# Altium schematic sheet ADCS_Sensor_Simulator.SchDoc
size C
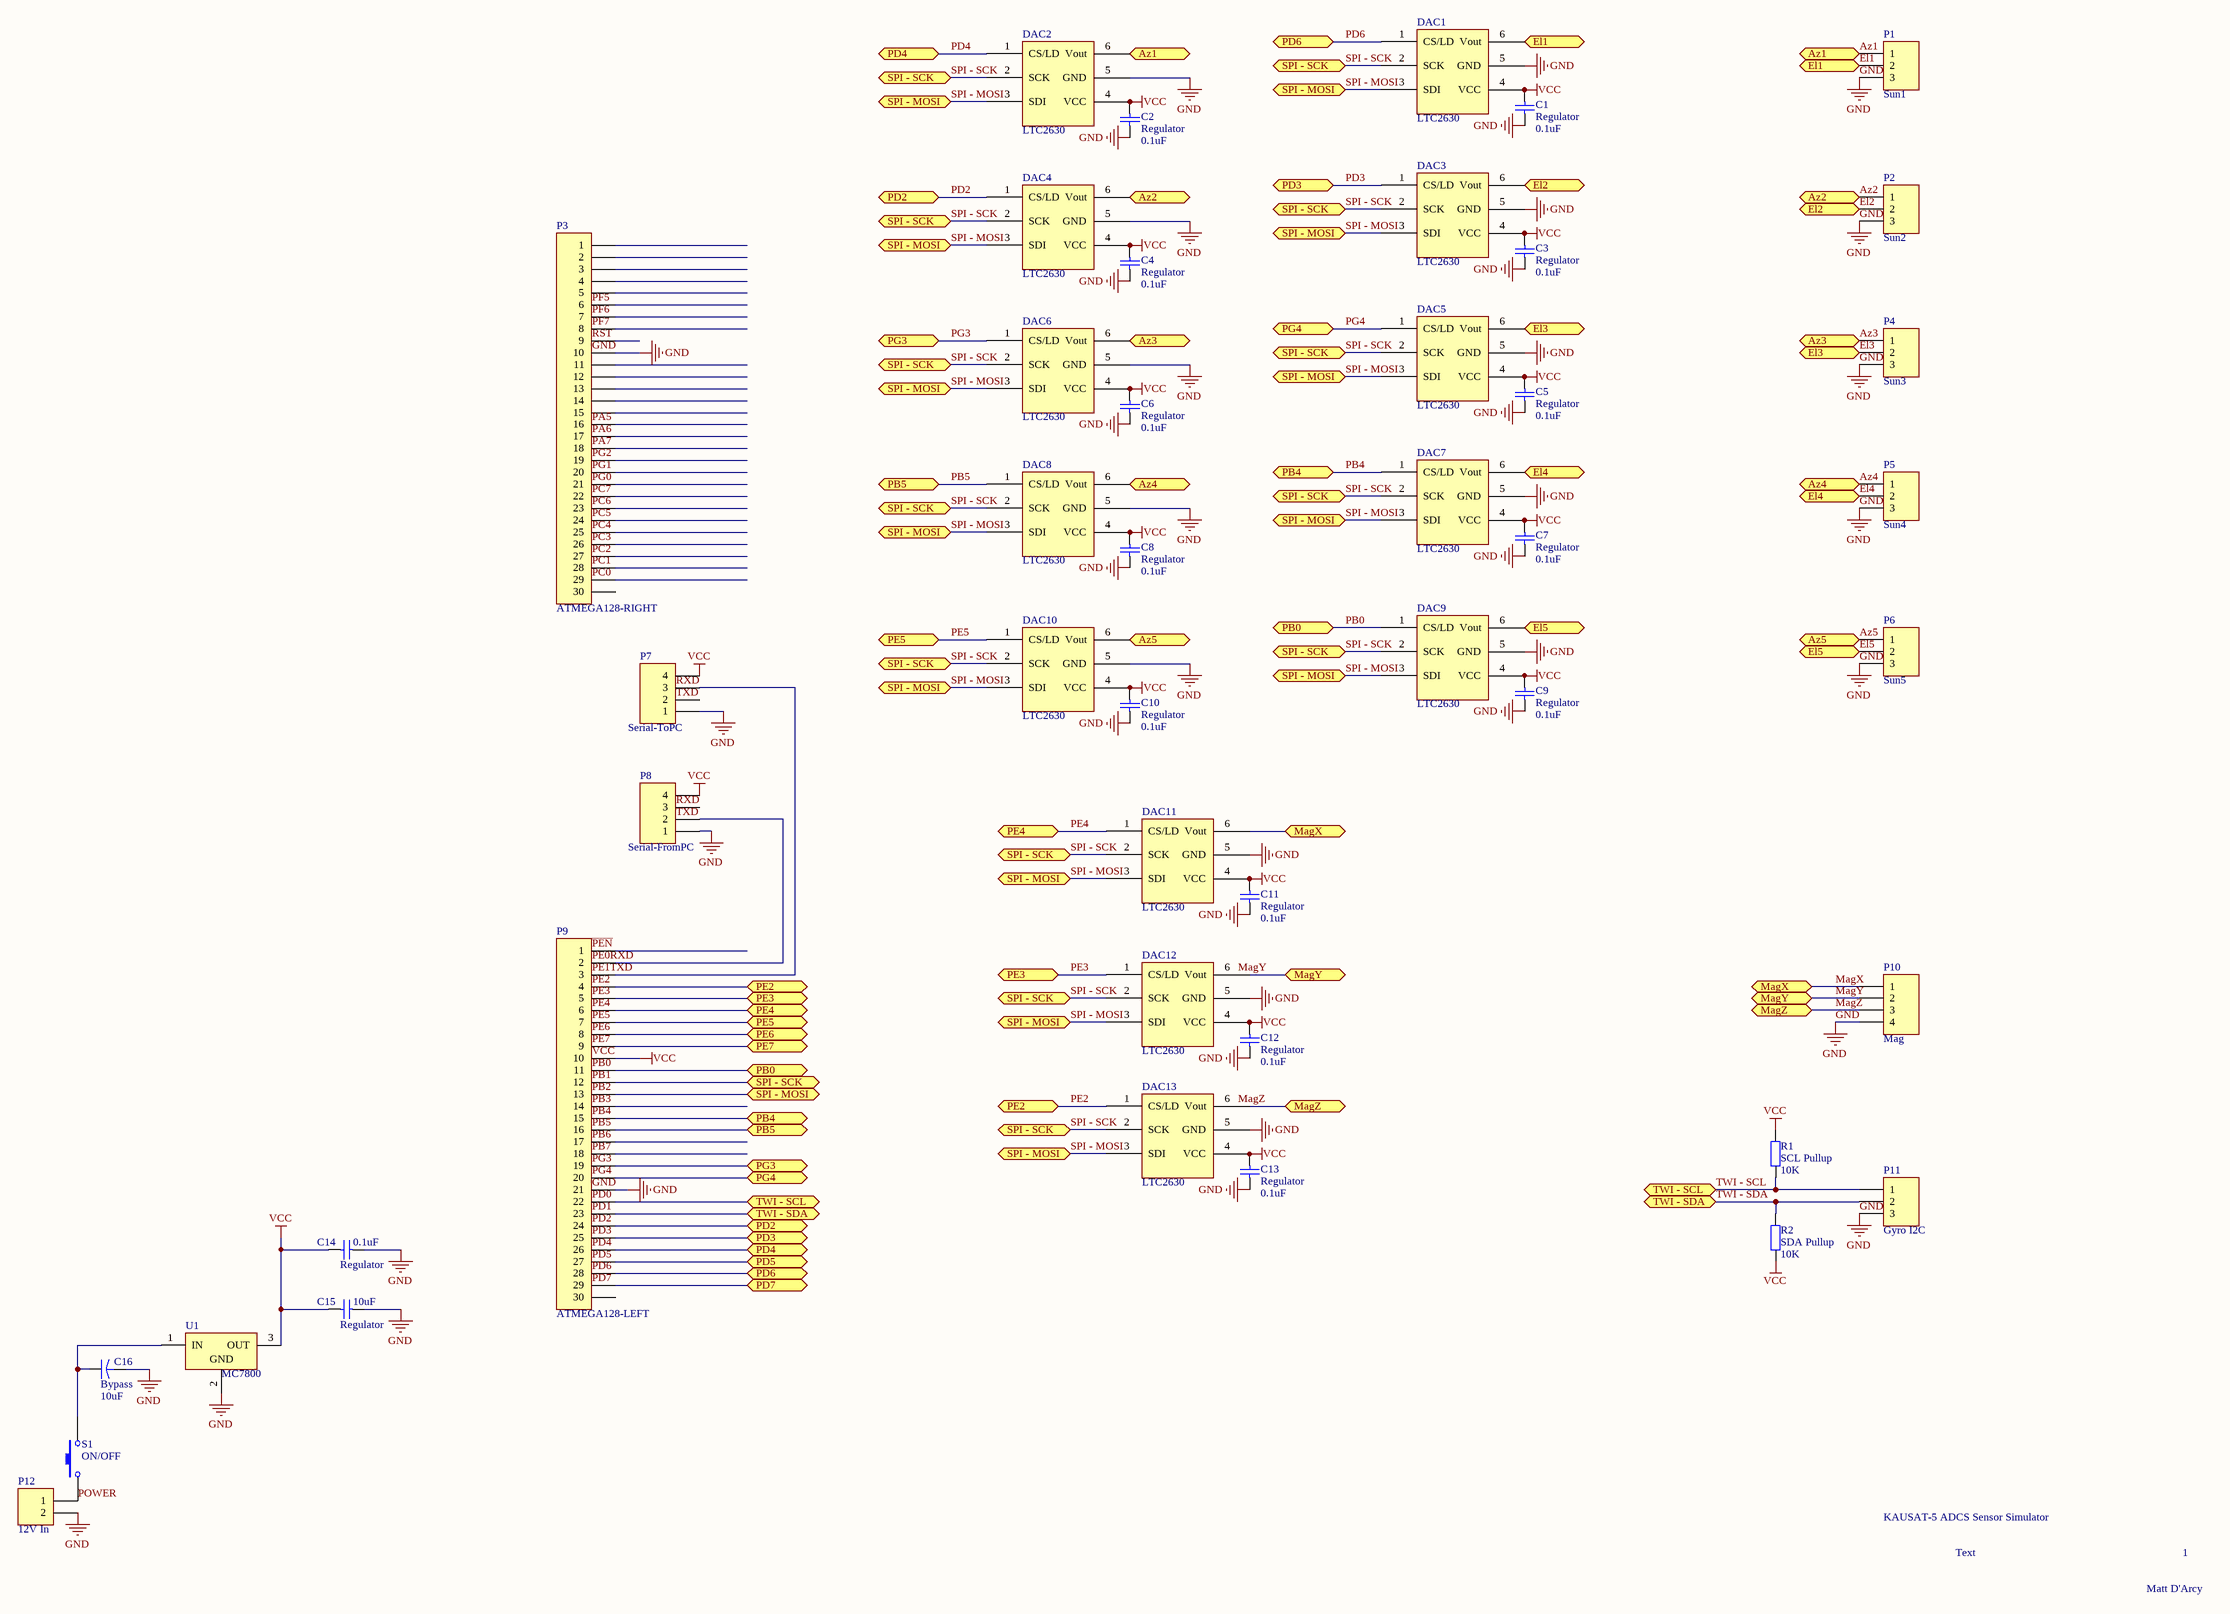
[diagram p0: ADCS_Sensor_Simulator.SchDoc]

## Parts
C1  Regulator  value 0.1uF  [6-0805_M]
C2  Regulator  value 0.1uF  [6-0805_M]
C3  Regulator  value 0.1uF  [6-0805_M]
C4  Regulator  value 0.1uF  [6-0805_M]
C5  Regulator  value 0.1uF  [6-0805_M]
C6  Regulator  value 0.1uF  [6-0805_M]
C7  Regulator  value 0.1uF  [6-0805_M]
C8  Regulator  value 0.1uF  [6-0805_M]
C9  Regulator  value 0.1uF  [6-0805_M]
C10  Regulator  value 0.1uF  [6-0805_M]
C11  Regulator  value 0.1uF  [6-0805_M]
C12  Regulator  value 0.1uF  [6-0805_M]
C13  Regulator  value 0.1uF  [6-0805_M]
C14  Regulator  value 0.1uF  [RAD-0.3]
C15  Regulator  value 10uF  [RAD-0.3]
C16  Bypass  value 10uF  [CAPR5-4X5]
DAC1  LTC2630  [LTC2630]
DAC2  LTC2630  [LTC2630]
DAC3  LTC2630  [LTC2630]
DAC4  LTC2630  [LTC2630]
DAC5  LTC2630  [LTC2630]
DAC6  LTC2630  [LTC2630]
DAC7  LTC2630  [LTC2630]
DAC8  LTC2630  [LTC2630]
DAC9  LTC2630  [LTC2630]
DAC10  LTC2630  [LTC2630]
DAC11  LTC2630  [LTC2630]
DAC12  LTC2630  [LTC2630]
DAC13  LTC2630  [LTC2630]
P1  Sun1  [HDR1X3]
P2  Sun2  [HDR1X3]
P3  ATMEGA128-RIGHT  [HDR1X30]
P4  Sun3  [HDR1X3]
P5  Sun4  [HDR1X3]
P6  Sun5  [HDR1X3]
P7  Serial-ToPC  [HDR1X4]
P8  Serial-FromPC  [HDR1X4]
P9  ATMEGA128-LEFT  [HDR1X30]
P10  Mag  [HDR1X4]
P11  Gyro I2C  [HDR1X3]
P12  12V In  [HDR1X2]
R1  SCL Pullup  value 10K  [6-0805_M]
R2  SDA Pullup  value 10K  [6-0805_M]
S1  ON/OFF  [SPST-2]
U1  MC7800  [221A-06]

## Ports
Az1, Az2, Az3, Az4, Az5, El1, El2, El3, El4, El5, MagX, MagY, MagZ, PB0, PB4, PB5, PD2, PD3, PD4, PD5, PD6, PD7, PE2, PE3, PE4, PE5, PE6, PE7, PG3, PG4, SPI - MOSI, SPI - SCK, TWI - SCL, TWI - SDA

## Nets
GND: C1.2 C2.2 C3.2 C4.2 C5.2 C6.2 C7.2 C8.2 C9.2 C10.2 C11.2 C12.2 C13.2 C14.2 C15.2 C16.2 DAC1.5(GND) DAC2.5(GND) DAC3.5(GND) DAC4.5(GND) DAC5.5(GND) DAC6.5(GND) DAC7.5(GND) DAC8.5(GND) DAC9.5(GND) DAC10.5(GND) DAC11.5(GND) DAC12.5(GND) DAC13.5(GND) P1.3 P2.3 P3.10 P4.3 P5.3 P6.3 P7.1 P8.1 P9.21 P10.4 P11.3 P12.2 U1.2(GND)
VCC: C1.1 C2.1 C3.1 C4.1 C5.1 C6.1 C7.1 C8.1 C9.1 C10.1 C11.1 C12.1 C13.1 C14.1 C15.1 DAC1.4(VCC) DAC2.4(VCC) DAC3.4(VCC) DAC4.4(VCC) DAC5.4(VCC) DAC6.4(VCC) DAC7.4(VCC) DAC8.4(VCC) DAC9.4(VCC) DAC10.4(VCC) DAC11.4(VCC) DAC12.4(VCC) DAC13.4(VCC) P7.4 P8.4 P9.10 R1.1 R2.1 U1.3(OUT)
Az1: DAC2.6(Vout) P1.1 ; port Az1
Az2: DAC4.6(Vout) P2.1 ; port Az2
Az3: DAC6.6(Vout) P4.1 ; port Az3
Az4: DAC8.6(Vout) P5.1 ; port Az4
Az5: DAC10.6(Vout) P6.1 ; port Az5
El1: DAC1.6(Vout) P1.2 ; port El1
El2: DAC3.6(Vout) P2.2 ; port El2
El3: DAC5.6(Vout) P4.2 ; port El3
El4: DAC7.6(Vout) P5.2 ; port El4
El5: DAC9.6(Vout) P6.2 ; port El5
MagX: DAC11.6(Vout) P10.1 ; port MagX
MagY: DAC12.6(Vout) P10.2 ; port MagY
MagZ: DAC13.6(Vout) P10.3 ; port MagZ
PB0: DAC9.1(CS/LD) P9.11 ; port PB0
PB4: DAC7.1(CS/LD) P9.15 ; port PB4
PB5: DAC8.1(CS/LD) P9.16 ; port PB5
PD2: DAC4.1(CS/LD) P9.24 ; port PD2
PD3: DAC3.1(CS/LD) P9.25 ; port PD3
PD4: DAC2.1(CS/LD) P9.26 ; port PD4
PD5: P9.27 ; port PD5
PD6: DAC1.1(CS/LD) P9.28 ; port PD6
PD7: P9.29 ; port PD7
PE2: DAC13.1(CS/LD) P9.4 ; port PE2
PE3: DAC12.1(CS/LD) P9.5 ; port PE3
PE4: DAC11.1(CS/LD) P9.6 ; port PE4
PE5: DAC10.1(CS/LD) P9.7 ; port PE5
PE6: P9.8 ; port PE6
PE7: P9.9 ; port PE7
PG3: DAC6.1(CS/LD) P9.19 ; port PG3
PG4: DAC5.1(CS/LD) P9.20 ; port PG4
POWER: P12.1 S1.1
SPI - MOSI: DAC1.3(SDI) DAC2.3(SDI) DAC3.3(SDI) DAC4.3(SDI) DAC5.3(SDI) DAC6.3(SDI) DAC7.3(SDI) DAC8.3(SDI) DAC9.3(SDI) DAC10.3(SDI) DAC11.3(SDI) DAC12.3(SDI) DAC13.3(SDI) P9.13 ; port SPI - MOSI
SPI - SCK: DAC1.2(SCK) DAC2.2(SCK) DAC3.2(SCK) DAC4.2(SCK) DAC5.2(SCK) DAC6.2(SCK) DAC7.2(SCK) DAC8.2(SCK) DAC9.2(SCK) DAC10.2(SCK) DAC11.2(SCK) DAC12.2(SCK) DAC13.2(SCK) P9.12 ; port SPI - SCK
TWI - SCL: P9.22 P11.1 R1.2 ; port TWI - SCL
TWI - SDA: P9.23 P11.2 R2.2 ; port TWI - SDA
NetC16_1: C16.1 S1.2 U1.1(IN)
NetP7_3: P7.3 P9.3
NetP8_2: P8.2 P9.2

Not connected (* = marked no-connect by the designer): P3 1 2 3 4 5 6 7 8 9 11 12 13 14 15 16 17 18 19 20 21 22 23 24 25 26 27 28 29 30; P7 2; P8 3; P9 1 14 17 18 30

## Notes on the sheet
- KAUSAT-5 ADCS Sensor Simulator
- Text
- Matt D'Arcy
- 1
- Labels drawn without touching a wire or pin: GND, MagY, MagZ, PA5, PA6, PA7, PB0, PB1, PB2, PB3, PB4, PB5, PB6, PB7, PC0, PC1, PC2, PC3, PC4, PC5, PC6, PC7, PD0, PD1, PD2, PD3, PD4, PD5, PD6, PD7, PE0RXD, PE1TXD, PE2, PE3, PE4, PE5, PE6, PE7, PF5, PF6, PF7, PG0, PG1, PG2, PG3, PG4, RST, RXD, TXD, VCC, ~{PEN}

## Library data of the parts
C1-C15 = Cap: Capacitor; Published: 8-Jun-2000; LatestRevisionDate: 17-Jul-2002; LatestRevisionNote: Re-released for DXP Platform.; PackageReference: RAD-0.3; Publisher: Altium Limited; PackageDescription: Radial Cap, Thru-Hole; 2 Leads; 0.3 in Pin Spacing
C16 = Cap2: Capacitor; Published: 23-Sep-2002; PackageReference: CAPR5-4X5; Publisher: Altium Limited; PackageDescription: Capacitor; 2 Leads
P1 P2 P4-P6 P11 = Header 3: Header, 3-Pin; LatestRevisionDate: 17-Jul-2002; LatestRevisionNote: Re-released for DXP Platform.; Publisher: Altium Limited
P3 P9 = Header 30: Header, 30-Pin; LatestRevisionDate: 17-Jul-2002; LatestRevisionNote: Re-released for DXP Platform.; Publisher: Altium Limited
P7 P8 P10 = Header 4: Header, 4-Pin; LatestRevisionDate: 17-Jul-2002; LatestRevisionNote: Re-released for DXP Platform.; Publisher: Altium Limited
P12 = Header 2: Header, 2-Pin; LatestRevisionDate: 17-Jul-2002; LatestRevisionNote: Re-released for DXP Platform.; Publisher: Altium Limited
R1 R2 = Res2: Resistor; Published: 8-Jun-2000; LatestRevisionDate: 17-Jul-2002; LatestRevisionNote: Re-released for DXP Platform.; PackageReference: AXIAL-0.4; Publisher: Altium Limited; PackageDescription: Axial Device, Thru-Hole; 2 Leads; 0.4 in Pin Spacing
S1 = SW-PB: Switch; Published: 24-Mar-1999; LatestRevisionDate: 17-Jul-2002; LatestRevisionNote: Re-released for DXP Platform.; PackageReference: SPST-2; Publisher: Altium Limited; PackageDescription: Switch; 2 Leads
U1 = MC7805ACT: Three-Terminal Positive Voltage Regulator; Note: Heatsink surface is connected to Pin 2; Published: 15-Apr-2002; DatasheetVersion: 1997; PackageVersion: 1997; PackageReference: 221A-06; Publisher: Altium Limited; PackageDescription: TO, Thru-Hole, Vertical, Heatsink Mounted; 3 In-Line Leads; Pitch 2.54 mm; Code_JEDEC: TO-262-AA; ComponentLink1Description: Manufacturer Link; ComponentLink1URL: http://www.onsemi.com/site/products/taxonomy/0,4438,503,00.html; ComponentLink2Description: Datasheet; ComponentLink2URL: http://www.onsemi.com/pub/Collateral/MC7800-D.PDF